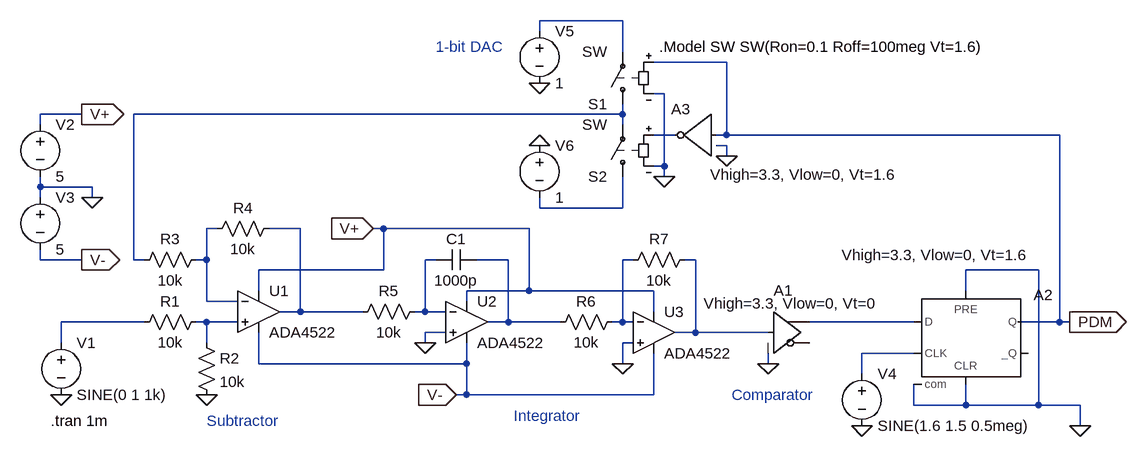
[diagram p0: schematic dsm_step1.asc]
dsm_step1.asc, the LTspice schematic file:
Version 4
SHEET 1 1752 680
WIRE 896 -368 768 -368
WIRE 768 -352 768 -368
WIRE 896 -320 896 -368
WIRE 1056 -304 944 -304
WIRE 960 -256 944 -256
WIRE 64 -224 0 -224
WIRE 896 -224 896 -240
WIRE 896 -224 144 -224
WIRE 0 -208 0 -224
WIRE 896 -208 896 -224
WIRE 976 -192 944 -192
WIRE 1056 -192 1056 -304
WIRE 1056 -192 1040 -192
WIRE 1568 -192 1056 -192
WIRE 1056 -176 1040 -176
WIRE 1056 -160 1056 -176
WIRE 960 -144 960 -256
WIRE 960 -144 944 -144
WIRE 960 -128 960 -144
WIRE 0 -112 0 -128
WIRE 80 -112 0 -112
WIRE 0 -96 0 -112
WIRE 80 -96 80 -112
WIRE 768 -80 768 -96
WIRE 896 -80 896 -128
WIRE 896 -80 768 -80
WIRE 272 -48 256 -48
WIRE 400 -48 352 -48
WIRE 528 -48 512 -48
WIRE 752 -48 528 -48
WIRE 0 0 0 -16
WIRE 64 0 0 0
WIRE 144 0 144 -224
WIRE 160 0 144 0
WIRE 256 0 256 -48
WIRE 256 0 240 0
WIRE 608 0 592 0
WIRE 720 0 672 0
WIRE 912 0 896 0
WIRE 1008 0 992 0
WIRE 528 16 528 -48
WIRE 528 16 336 16
WIRE 1536 16 1424 16
WIRE 336 48 336 16
WIRE 752 48 752 -48
WIRE 752 48 656 48
WIRE 944 48 752 48
WIRE 1424 48 1424 16
WIRE 256 64 256 0
WIRE 304 64 256 64
WIRE 656 64 656 48
WIRE 400 80 400 -48
WIRE 400 80 368 80
WIRE 496 80 400 80
WIRE 592 80 592 0
WIRE 592 80 576 80
WIRE 624 80 592 80
WIRE 944 80 944 48
WIRE 160 96 32 96
WIRE 256 96 240 96
WIRE 304 96 256 96
WIRE 720 96 720 0
WIRE 720 96 688 96
WIRE 800 96 720 96
WIRE 896 96 896 0
WIRE 896 96 880 96
WIRE 912 96 896 96
WIRE 1344 96 1184 96
WIRE 1568 96 1568 -192
WIRE 1568 96 1504 96
WIRE 1584 96 1568 96
WIRE 624 112 592 112
WIRE 1008 112 1008 0
WIRE 1008 112 976 112
WIRE 1120 112 1008 112
WIRE 32 128 32 96
WIRE 256 128 256 96
WIRE 592 128 592 112
WIRE 912 128 896 128
WIRE 1344 144 1264 144
WIRE 336 160 336 112
WIRE 656 160 656 128
WIRE 656 160 336 160
WIRE 896 160 896 128
WIRE 1120 160 1120 144
WIRE 1264 176 1264 144
WIRE 656 208 656 160
WIRE 656 208 640 208
WIRE 944 208 944 144
WIRE 944 208 656 208
WIRE 1344 224 1344 192
WIRE 1424 224 1424 192
WIRE 1424 224 1344 224
WIRE 1536 224 1536 16
WIRE 1536 224 1424 224
WIRE 1600 224 1536 224
WIRE 1600 256 1600 224
FLAG 592 128 0
FLAG 896 160 0
FLAG 256 208 0
FLAG 32 208 0
FLAG 512 -48 V+
IOPIN 512 -48 In
FLAG 640 208 V-
IOPIN 640 208 In
FLAG 80 -96 0
FLAG 64 -224 V+
IOPIN 64 -224 Out
FLAG 64 0 V-
IOPIN 64 0 Out
FLAG 1120 160 0
FLAG 1264 256 0
FLAG 1600 256 0
FLAG 1056 -160 0
FLAG 960 -128 0
FLAG 768 -272 0
FLAG 768 -176 0
FLAG 1584 96 PDM
IOPIN 1584 96 Out
SYMBOL voltage 32 112 R0
WINDOW 123 0 0 Left 0
WINDOW 39 0 0 Left 0
SYMATTR InstName V1
SYMATTR Value SINE(0 1 1k)
SYMBOL OpAmps\\ADA4522 336 16 R0
SYMATTR InstName U1
SYMBOL OpAmps\\ADA4522 656 32 R0
SYMATTR InstName U2
SYMBOL OpAmps\\ADA4522 944 48 R0
SYMATTR InstName U3
SYMBOL res 256 80 R90
WINDOW 0 0 56 VBottom 2
WINDOW 3 32 56 VTop 2
SYMATTR InstName R1
SYMATTR Value 10k
SYMBOL res 240 112 R0
SYMATTR InstName R2
SYMATTR Value 10k
SYMBOL res 256 -16 R90
WINDOW 0 0 56 VBottom 2
WINDOW 3 32 56 VTop 2
SYMATTR InstName R3
SYMATTR Value 10k
SYMBOL res 368 -64 R90
WINDOW 0 0 56 VBottom 2
WINDOW 3 32 56 VTop 2
SYMATTR InstName R4
SYMATTR Value 10k
SYMBOL res 592 64 R90
WINDOW 0 0 56 VBottom 2
WINDOW 3 32 56 VTop 2
SYMATTR InstName R5
SYMATTR Value 10k
SYMBOL res 896 80 R90
WINDOW 0 0 56 VBottom 2
WINDOW 3 32 56 VTop 2
SYMATTR InstName R6
SYMATTR Value 10k
SYMBOL res 1008 -16 R90
WINDOW 0 0 56 VBottom 2
WINDOW 3 32 56 VTop 2
SYMATTR InstName R7
SYMATTR Value 10k
SYMBOL cap 672 -16 R90
WINDOW 0 0 32 VBottom 2
WINDOW 3 32 32 VTop 2
SYMATTR InstName C1
SYMATTR Value 1000p
SYMBOL voltage 0 -224 R0
WINDOW 123 0 0 Left 0
WINDOW 39 0 0 Left 0
SYMATTR InstName V2
SYMATTR Value 5
SYMBOL voltage 0 -112 R0
WINDOW 123 0 0 Left 0
WINDOW 39 0 0 Left 0
SYMATTR InstName V3
SYMATTR Value 5
SYMBOL Digital\\buf 1120 48 R0
WINDOW 0 8 -1 Left 2
WINDOW 3 -99 19 Left 2
SYMATTR InstName A1
SYMATTR Value Vhigh=3.3, Vlow=0, Vt=0
SYMBOL Digital\\dflop 1424 48 R0
WINDOW 3 -191 -55 Left 2
SYMATTR Value Vhigh=3.3, Vlow=0, Vt=1.6
SYMATTR InstName A2
SYMBOL voltage 1264 160 R0
WINDOW 123 0 0 Left 0
WINDOW 39 0 0 Left 0
SYMATTR InstName V4
SYMATTR Value SINE(1.6 1.5 0.5meg)
SYMBOL sw 896 -224 R180
SYMATTR InstName S1
SYMBOL sw 896 -112 R180
SYMATTR InstName S2
SYMBOL Digital\\inv 1040 -256 M0
WINDOW 3 -277 125 Left 2
SYMATTR Value Vhigh=3.3, Vlow=0, Vt=1.6
SYMATTR InstName A3
SYMBOL voltage 768 -368 R0
WINDOW 123 0 0 Left 0
WINDOW 39 0 0 Left 0
SYMATTR InstName V5
SYMATTR Value 1
SYMBOL voltage 768 -192 R0
WINDOW 123 0 0 Left 0
WINDOW 39 0 0 Left 0
SYMATTR InstName V6
SYMATTR Value 1
TEXT 256 248 Left 2 ;Subtractor
TEXT 728 240 Left 2 ;Integrator
TEXT 1064 208 Left 2 ;Comparator
TEXT 952 -328 Left 2 !.Model SW SW(Ron=0.1 Roff=100meg Vt=1.6)
TEXT 608 -328 Left 2 ;1-bit DAC
TEXT 16 248 Left 2 !.tran 1m

The netlist it stands for:
* dsm_step1.asc
V1 N011 0 SINE(0 1 1k)
XU1 N012 N005 V+ V- N006 ADA4522  ; pins In+ In- V+ V- OUT
XU2 0 N007 V+ V- N008 ADA4522  ; pins In+ In- V+ V- OUT
XU3 0 N009 V+ V- N010 ADA4522  ; pins In+ In- V+ V- OUT
R1 N012 N011 10k
R2 N012 0 10k
R3 N005 N002 10k
R4 N006 N005 10k
R5 N007 N006 10k
R6 N009 N008 10k
R7 N010 N009 10k
C1 N008 N007 1000p
V2 V+ 0 5
V3 0 V- 5
A1 N010 0 0 0 0 0 N013 0 BUF Vhigh=3.3, Vlow=0, Vt=0
A2 N013 0 N014 0 0 0 PDM 0 DFLOP Vhigh=3.3, Vlow=0, Vt=1.6
V4 N014 0 SINE(1.6 1.5 0.5meg)
S1 N002 N001 PDM 0 SW
S2 N004 N002 N003 0 SW
A3 PDM 0 0 0 0 N003 0 0 BUF Vhigh=3.3, Vlow=0, Vt=1.6
V5 N001 0 1
V6 0 N004 1
* Subtractor
* Integrator
* Comparator
.Model SW SW(Ron=0.1 Roff=100meg Vt=1.6)
* 1-bit DAC
.tran 1m
.backanno
.end